# Altium schematic sheet P02_MCU.SchDoc
size A4; SheetNumber: 2; SheetTotal: 3
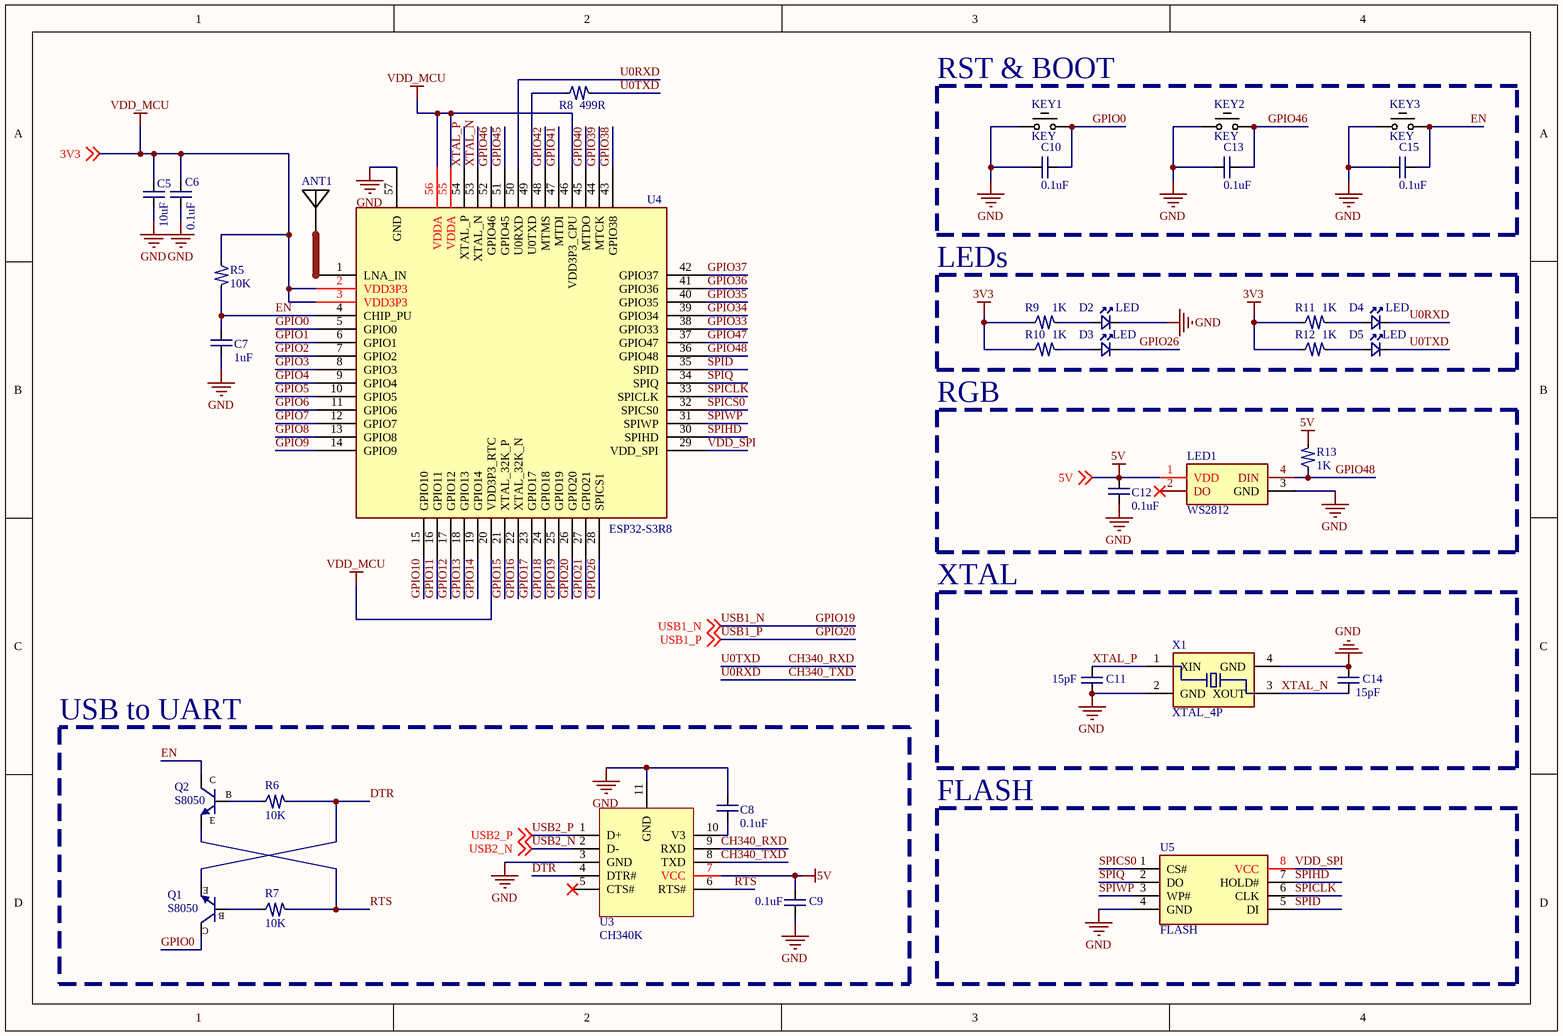
[diagram p0: P02_MCU.SchDoc]

## Parts
ANT1  ANT  [CrossAir_CAC03]  (value not drawn)
C5  10uF  [C_0402]
C6  0.1uF  [C_0402]
C7  1uF  [C_0402]
C8  0.1uF  [C_0603]
C9  0.1uF  [C_0603]
C10  0.1uF  [C_0603]
C11  15pF  [C_0402]
C12  0.1uF  [C_0603]
C13  0.1uF  [C_0603]
C14  15pF  [C_0402]
C15  0.1uF  [C_0603]
D2  LED  [LED_0603]
D3  LED  [LED_0603]
D4  LED  [LED_0603]
D5  LED  [LED_0603]
KEY1  KEY  [KEY]
KEY2  KEY  [KEY]
KEY3  KEY  [KEY]
LED1  WS2812  [SMD5050]
Q1  S8050  [SOT-23-3]
Q2  S8050  [SOT-23-3]
R5  10K  [R_0402]
R6  10K  [R_0603]
R7  10K  [R_0603]
R8  499R  [R_0402]
R9  1K  [R_0603]
R10  1K  [R_0603]
R11  1K  [R_0603]
R12  1K  [R_0603]
R13  1K  [R_0603]
U3  CH340K  [ESOP-10]
U4  ESP32-S3R8  [QFN-56]
U5  FLASH  [SOIC-8-208mil]
X1  XTAL_4P  [X_SMD3225]

## Blocks framed on the sheet
RST & BOOT: C10 C13 C15 KEY1-KEY3
LEDs: D2-D5 R9-R12
RGB: C12 LED1 R13
XTAL: C11 C14 X1
USB to UART: C8 C9 Q1 Q2 R6 R7 U3
FLASH: U5

## Nets
3V3: C5.1 C6.1 R5.2 R9.2 R10.2 R11.2 R12.2 U4.2(VDD3P3) U4.3(VDD3P3) U4.20(VDD3P3_RTC) U4.46(VDD3P3_CPU) U4.55(VDDA) U4.56(VDDA) ; off-sheet 3V3  [also labelled VDD_MCU]
5V: C9.2 C12.2 LED1.1(VDD) R13.1 U3.7(VCC) ; off-sheet 5V
GND: C5.2 C6.2 C7.1 C8.1 C9.1 C10.2 C11.1 C12.1 C13.2 C14.2 C15.2 D2.1 KEY1.2 KEY2.2 KEY3.2 LED1.3(GND) U3.3(GND) U3.11(GND) U4.57(GND) U5.4(GND) X1.2(GND) X1.4(GND)
CH340_RXD: D5.1 R8.1 U3.9(RXD)  [also labelled U0TXD]
CH340_TXD: D4.1 U3.8(TXD) U4.50(U0RXD)  [also labelled U0RXD]
DTR: Q1.2(E) R6.1 U3.4(DTR#)
EN: C7.2 C15.1 KEY3.1 Q2.3(C) R5.1 U4.4(CHIP_PU)
GPIO0: C10.1 KEY1.1 Q1.3(C) U4.5(GPIO0)
GPIO1: U4.6(GPIO1)
GPIO2: U4.7(GPIO2)
GPIO3: U4.8(GPIO3)
GPIO4: U4.9(GPIO4)
GPIO5: U4.10(GPIO5)
GPIO6: U4.11(GPIO6)
GPIO7: U4.12(GPIO7)
GPIO8: U4.13(GPIO8)
GPIO9: U4.14(GPIO9)
GPIO10: U4.15(GPIO10)
GPIO11: U4.16(GPIO11)
GPIO12: U4.17(GPIO12)
GPIO13: U4.18(GPIO13)
GPIO14: U4.19(GPIO14)
GPIO15: U4.21(XTAL_32K_P)
GPIO16: U4.22(XTAL_32K_N)
GPIO17: U4.23(GPIO17)
GPIO18: U4.24(GPIO18)
GPIO19: U4.25(GPIO19) ; off-sheet USB1_N  [also labelled USB1_N]
GPIO20: U4.26(GPIO20) ; off-sheet USB1_P  [also labelled USB1_P]
GPIO21: U4.27(GPIO21)
GPIO26: D3.1 U4.28(SPICS1)
GPIO33: U4.38(GPIO33)
GPIO34: U4.39(GPIO34)
GPIO35: U4.40(GPIO35)
GPIO36: U4.41(GPIO36)
GPIO37: U4.42(GPIO37)
GPIO38: U4.43(GPIO38)
GPIO39: U4.44(MTCK)
GPIO40: U4.45(MTDO)
GPIO41: U4.47(MTDI)
GPIO42: U4.48(MTMS)
GPIO45: U4.51(GPIO45)
GPIO46: C13.1 KEY2.1 U4.52(GPIO46)
GPIO47: U4.37(GPIO47)
GPIO48: LED1.4(DIN) R13.2 U4.36(GPIO48)
RTS: Q2.2(E) R7.1 U3.6(RTS#)
SPICLK: U4.33(SPICLK) U5.6(CLK)
SPICS0: U4.32(SPICS0) U5.1(CS#)
SPID: U4.35(SPID) U5.5(DI)
SPIHD: U4.30(SPIHD) U5.7(HOLD#)
SPIQ: U4.34(SPIQ) U5.2(DO)
SPIWP: U4.31(SPIWP) U5.3(WP#)
USB2_N: U3.2(D-) ; off-sheet USB2_N
USB2_P: U3.1(D+) ; off-sheet USB2_P
VDD_SPI: U4.29(VDD_SPI) U5.8(VCC)
XTAL_N: C14.1 U4.53(XTAL_N) X1.3(XOUT)
XTAL_P: C11.2 U4.54(XTAL_P) X1.1(XIN)
NetANT1_1: ANT1.1(Feed) U4.1(LNA_IN)
NetC8_2: C8.2 U3.10(V3)
NetD2_2: D2.2 R9.1
NetD3_2: D3.2 R10.1
NetD4_2: D4.2 R11.1
NetD5_2: D5.2 R12.1
NetQ1_1: Q1.1(B) R7.2
NetQ2_1: Q2.1(B) R6.2
NetR8_2: R8.2 U4.49(U0TXD)

Not connected (* = marked no-connect by the designer): LED1 2(DO)*; U3 5(CTS#)*

## Library data of the parts
ANT1 = ANT: 天线
C5-C15 = C: 无极性电容
D2-D5 = LED: 发光二极管
KEY1-KEY3 = KEY: 通用2脚按键
LED1 = WS2812: RGB
Q1 Q2 = NFET: 三极管
R5-R13 = R: 电阻
U3 = CH340K: USB-UART
U4 = ESP32-S3FN8: ESP32-S3 / SPICS1 connect to the QSPI PSRAM and / are not available for other use. / ESP32-S3-PICO-1-N8R8: / SPICS1 and IO33~IO37 connect to the OSPI / PSRAM and are not available for other use.
U5 = FLASH: NOR FLASH
X1 = XTAL_4P: 晶振 4P